# EAGLE design thermal_actuator_v1.0 (EAGLE 9.6.1)
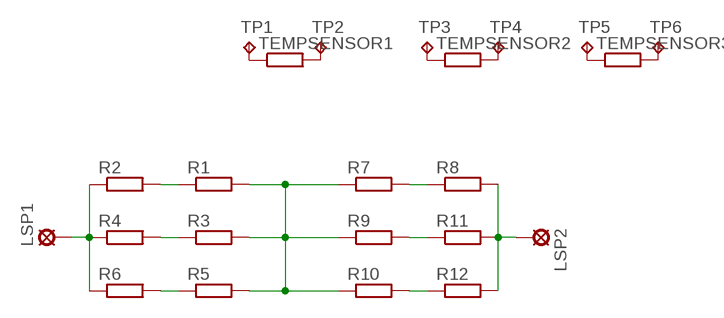
[diagram p0: schematic, sheet 1]

## Parts
LSP1  LSP10  [LSP10]
LSP2  LSP10  [LSP10]
R1  R-EU_R0402  [R0402]
R2  R-EU_R0402  [R0402]
R3  R-EU_R0402  [R0402]
R4  R-EU_R0402  [R0402]
R5  R-EU_R0402  [R0402]
R6  R-EU_R0402  [R0402]
R7  R-EU_R0402  [R0402]
R8  R-EU_R0402  [R0402]
R9  R-EU_R0402  [R0402]
R10  R-EU_R0402  [R0402]
R11  R-EU_R0402  [R0402]
R12  R-EU_R0402  [R0402]
TEMPSENSOR1  R-EU_R0402  [R0402]
TEMPSENSOR2  R-EU_R0402  [R0402]
TEMPSENSOR3  R-EU_R0402  [R0402]
TP1  TPTP10R  [TP10R]
TP2  TPTP10R  [TP10R]
TP3  TPTP10R  [TP10R]
TP4  TPTP10R  [TP10R]
TP5  TPTP10R  [TP10R]
TP6  TPTP10R  [TP10R]

## Nets
N$1: LSP2.MP R8.2 R11.2 R12.2
N$2: LSP1.MP R2.1 R4.1 R6.1
N$3: R1.1 R2.2
N$4: R3.1 R4.2
N$5: R5.1 R6.2
N$6: R1.2 R3.2 R5.2 R7.1 R9.1 R10.1
N$7: TEMPSENSOR1.1 TP1.TP
N$8: TEMPSENSOR1.2 TP2.TP
N$9: R9.2 R11.1
N$10: R7.2 R8.1
N$11: R10.2 R12.1
N$12: TEMPSENSOR2.1 TP3.TP
N$13: TEMPSENSOR2.2 TP4.TP
N$14: TEMPSENSOR3.1 TP5.TP
N$15: TEMPSENSOR3.2 TP6.TP

## Library data of the parts
LSP1 LSP2 = solpad:LSP10: SOLDER PAD drill 1.0 mm, distributor Buerklin, 12H555
R1-R12 TEMPSENSOR1-TEMPSENSOR3 = rcl:R-EU_: RESISTOR, European symbol; SPICEPREFIX: R
TP1-TP6 = testpad:TP: Test pad

## Board
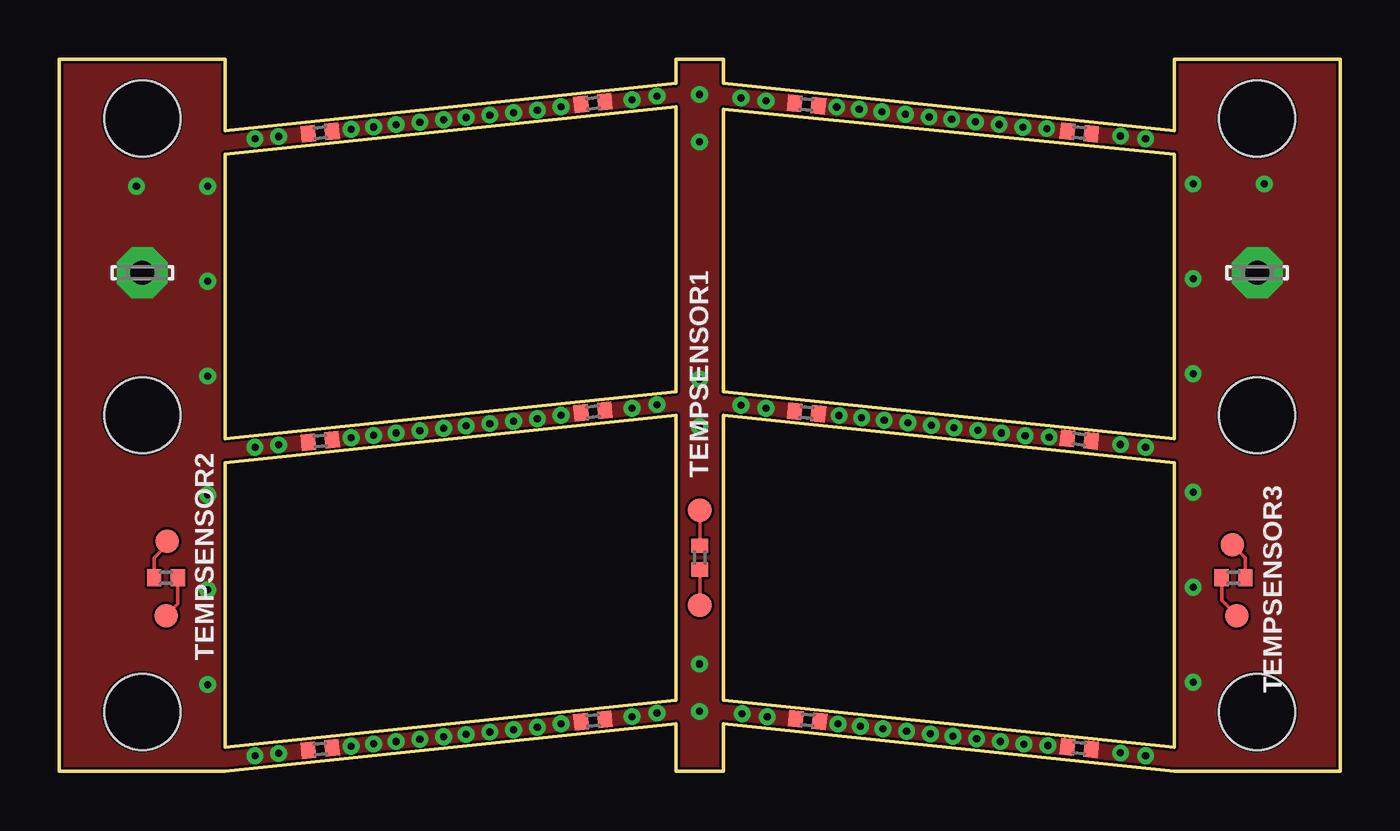
[diagram p1: board, top side]
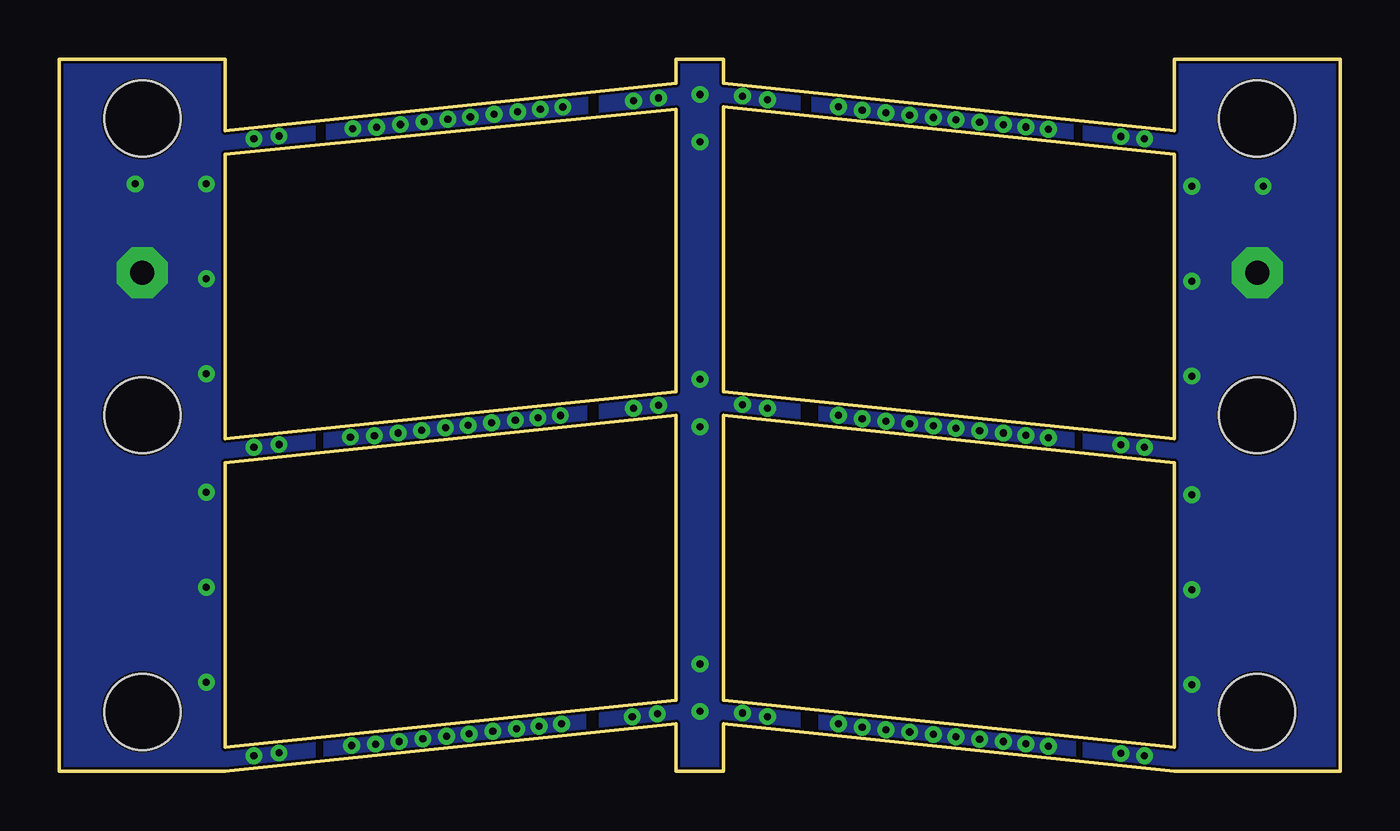
[diagram p2: board, bottom side, seen from below]

Size 54 x 30 mm. Coordinates in mm from the lower left corner, seen from the top.
Outline: 0,30 0,0 7,0 26,2 26,0 28,0 28,2 47,0 54,0 54,30 47,30 47,27 28,29 28,30 26,30 26,29 7,27 7,30 0,30
Outline: 26,28 7,26 7,14 26,16 26,28
Outline: 28,27.9 47,26 47,14 28,16 28,27.9
Outline: 7,13 26,15 26,3 7,1 7,13
Outline: 28,15 28,3 47,1 47,13 28,15
Copper layers (1*16): Top 0.035mm / dielectric 1.5mm / Bottom 0.035mm
Design rules "default *": minimum track width 6mil, minimum drill 0.35mm, track to track 4mil, track to pad 4mil, pad to pad 4mil, via to via 4mil, smd to smd 4mil, copper to edge 4mil, drill to drill 4mil, minimum pad ring 10mil, minimum via ring 8mil, stop-mask expansion 4mil, vias tented up to drill 0mil, thermal gap 10mil
Holes 3.2 mm at 3.5,27.5 3.5,15 3.5,2.5 50.5,27.5 50.5,15 50.5,2.5

### Footprints (pad centres in the part's own frame; a part is rotated, then mirrored left to right if it is on the bottom)
LSP10 = drill 1.016 pad 2.159 octagon: MP 0,0
R0402 = smd 0.6 x 0.7: 1 -0.5,0; 2 0.5,0
TP10R = smd 1 x 1: TP 0,0

### Placement (x,y rotation side)
LSP1  3.5,21 0 top
LSP2  50.5,21 0 top
R1  22.5,28.15 6 top
R2  11,26.91 6 top
R3  22.5,15.15 6 top
R4  11,13.91 6 top
R5  22.5,2.14 6 top
R6  11,0.94 6 top
R7  31.5,28.1 354 top
R8  43,26.92 354 top
R9  31.5,15.11 354 top
R10  31.55,2.16 354 top
R11  43,13.99 354 top
R12  43,0.98 354 top
TEMPSENSOR1  27,9 90 top
TEMPSENSOR2  4.5,8.15 0 top
TEMPSENSOR3  49.5,8.15 180 top
TP1  27,7 0 top
TP2  27,11 0 top
TP3  4.55,9.7 0 top
TP4  4.5,6.55 0 top
TP5  49.45,9.55 0 top
TP6  49.65,6.55 0 top

### Tracks (layer width: path | path; a pad name or v marks a point on that pad's centre or on a via)
N$1  (via drill 0.3)
  other vias: 44.74,26.77 45.8,26.65 44.74,13.77 45.8,13.65 44.74,0.77 45.8,0.65 47.8,16.75 47.8,11.75 47.8,7.75 47.8,3.75 47.8,20.75 47.8,24.75 50.8,24.75
  pour Top (no thermals): 43.5,31 43.5,-1 54,-1 54,31
  pour Bottom (no thermals): 43.2,31 43.2,-1 54,-1 54,31
N$2  (via drill 0.3)
  other vias: 9.25,13.75 8.25,13.65 9.25,26.75 8.25,26.65 9.25,0.75 8.25,0.65 6.25,16.65 6.25,11.65 6.25,7.65 6.25,3.65 6.25,20.65 6.25,24.65 3.25,24.65
  pour Top (no thermals): 0,30 10.65,30 10.65,0 0,0
  pour Bottom (no thermals): 0,30 10.85,30 10.85,0 0,0
N$3  (via drill 0.3)
  other vias: 12.3,27.05 13.25,27.15 14.2,27.25 15.2,27.35 16.2,27.45 17.15,27.55 18.15,27.65 19.15,27.75 20.15,27.85 20.15,27.85 21.15,28
  pour Top (no thermals): 11.5,30 11.5,25 22,25 22,30
  pour Bottom (no thermals): 11.25,30 11.25,25 22.3,25 22.3,30
N$4  (via drill 0.3)
  other vias: 12.3,14.05 13.25,14.15 14.2,14.25 15.2,14.35 16.2,14.45 17.15,14.55 18.15,14.65 19.15,14.75 20.15,14.85 20.15,14.85 21.15,15
  pour Top (no thermals): 11.5,16 11.5,12 22,12 22,16
  pour Bottom (no thermals): 11.2,16 11.2,12 22,12 22,16
N$5  (via drill 0.3)
  other vias: 12.3,1.05 13.25,1.15 14.2,1.25 15.2,1.35 16.2,1.45 17.15,1.55 18.15,1.65 19.15,1.75 20.15,1.85 20.15,1.85 21.15,2
  pour Top (no thermals): 11.25,4 11.25,-1 22,-1 22,4
  pour Bottom (no thermals): 11.15,4 11.15,-1 22,-1 22,4
N$6  (via drill 0.3)
  other vias: 24.15,15.3 25.2,15.45 24.15,2.3 25.2,2.45 24.15,28.3 25.2,28.45 28.74,15.42 29.8,15.3 28.79,2.42 29.85,2.3 28.74,28.37 29.8,28.25 26.99,2.52 26.99,4.52 26.99,14.52 26.99,16.52 26.99,28.52 26.99,26.52
  pour Top (no thermals): 23,30 23,0 31,0 31,29 31,30
  pour Bottom (no thermals): 22.75,30.05 22.75,0 31.25,0 31.25,30.05
N$7
  Top 0.152: TEMPSENSOR1.1 TP1.TP
N$8
  Top 0.152: TP2.TP TEMPSENSOR1.2
N$9  (via drill 0.3)
  other vias: 32.87,14.99 33.82,14.89 34.77,14.79 35.77,14.68 36.77,14.57 37.72,14.47 38.72,14.36 39.72,14.25 40.72,14.14 40.72,14.14 41.73,14.08
  pour Top (no thermals): 32,16 32,13 42.65,13 42.65,16
  pour Bottom (no thermals): 31.75,16 31.75,13 42.85,13 42.85,16
N$10  (via drill 0.3)
  other vias: 32.77,27.99 33.72,27.89 34.67,27.79 35.67,27.68 36.67,27.57 37.62,27.47 38.62,27.36 39.62,27.25 40.62,27.14 40.62,27.14 41.63,27.08
  pour Top (no thermals): 32,30 32,26 42.6,26 42.6,30
  pour Bottom (no thermals): 31.7,30 31.7,26 42.75,26 42.75,30
N$11  (via drill 0.3)
  other vias: 32.82,1.99 33.77,1.89 34.72,1.79 35.72,1.68 36.72,1.57 37.67,1.47 38.67,1.36 39.67,1.25 40.67,1.14 40.67,1.14 41.68,1.08
  pour Top (no thermals): 32,3 32,0 42.7,0 42.7,3
  pour Bottom (no thermals): 31.8,3 31.8,0 42.85,0 42.85,3
N$12
  Top 0.152: TP3.TP 4.55,9.55 4,9 TEMPSENSOR2.1
N$13
  Top 0.152: TP4.TP 5,7.05 TEMPSENSOR2.2
N$14
  Top 0.152: TP5.TP 50,9 TEMPSENSOR3.1
N$15
  Top 0.152: TP6.TP 49,7.2 TEMPSENSOR3.2